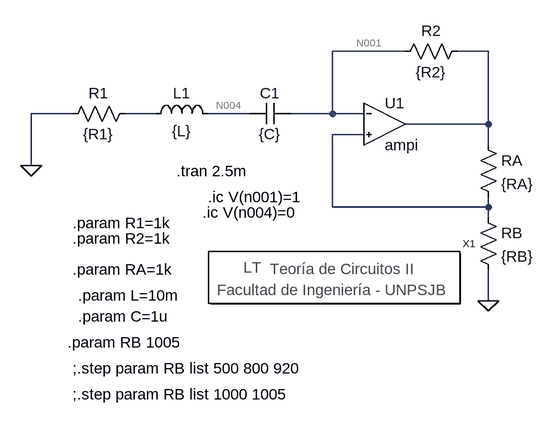
[diagram p0: schematic simulacion_ampi.asc]
simulacion_ampi.asc, the LTspice schematic file:
Version 4
SHEET 1 1012 680
WIRE 480 -176 368 -176
WIRE 608 -176 560 -176
WIRE -32 -80 -96 -80
WIRE 96 -80 48 -80
WIRE 240 -80 176 -80
WIRE 368 -80 368 -176
WIRE 368 -80 304 -80
WIRE 416 -80 368 -80
WIRE 608 -64 608 -176
WIRE 608 -64 480 -64
WIRE 416 -48 368 -48
WIRE 608 -32 608 -64
WIRE -96 0 -96 -80
WIRE 368 64 368 -48
WIRE 608 64 608 48
WIRE 608 64 368 64
WIRE 608 80 608 64
WIRE 608 208 608 160
FLAG -96 0 0
FLAG 608 208 0
SYMBOL res 64 -96 R90
WINDOW 0 0 56 VBottom 2
WINDOW 3 32 56 VTop 2
SYMATTR InstName R1
SYMATTR Value {R1}
SYMBOL res 576 -192 R90
WINDOW 0 0 56 VBottom 2
WINDOW 3 32 56 VTop 2
SYMATTR InstName R2
SYMATTR Value {R2}
SYMBOL ind 80 -64 R270
WINDOW 0 32 56 VTop 2
WINDOW 3 5 56 VBottom 2
SYMATTR InstName L1
SYMATTR Value {L}
SYMATTR SpiceLine Rser=0
SYMBOL cap 304 -96 R90
WINDOW 0 0 32 VBottom 2
WINDOW 3 32 32 VTop 2
SYMATTR InstName C1
SYMATTR Value {C}
SYMBOL res 592 -48 R0
SYMATTR InstName RA
SYMATTR Value {RA}
SYMBOL res 592 64 R0
SYMATTR InstName RB
SYMATTR Value {RB}
SYMBOL Circuitos2\\Letreros\\Teoría\ de\ Circuitos\ II 368 176 R0
SYMATTR InstName X1
SYMBOL Circuitos2\\ComponentesIdeales\\ampi 448 -128 R0
SYMATTR InstName U1
TEXT -32 88 Left 2 !.param R1=1k
TEXT -32 112 Left 2 !.param R2=1k
TEXT -32 160 Left 2 !.param RA=1k
TEXT -24 200 Left 2 !.param L=10m
TEXT -24 232 Left 2 !.param C=1u
TEXT 128 8 Left 2 !.tran 2.5m
TEXT -40 272 Left 2 !.param RB 1005
TEXT 176 48 Left 2 !.ic V(n001)=1
TEXT 168 72 Left 2 !.ic V(n004)=0
TEXT -32 312 Left 2 !;.step param RB list 500 800 920
TEXT -32 352 Left 2 !;.step param RB list 1000 1005

The netlist it stands for:
* simulacion_ampi.asc
R1 N003 0 {R1}
R2 N002 N001 {R2}
L1 N003 N004 {L} Rser=0
C1 N001 N004 {C}
RA N002 N005 {RA}
RB N005 0 {RB}
XX1 Teoría de Circuitos II
XU1 N005 N001 N002 ampi Ren=1e9, Rsal=1, A=1e9  ; pins p n s
.param R1=1k
.param R2=1k
.param RA=1k
.param L=10m
.param C=1u
.tran 2.5m
.param RB 1005
.ic V(n001)=1
.ic V(n004)=0
;.step param RB list 500 800 920
;.step param RB list 1000 1005
.lib ..\sym\Circuitos2\ComponentesIdeales\compoideales.lib
.backanno
.end